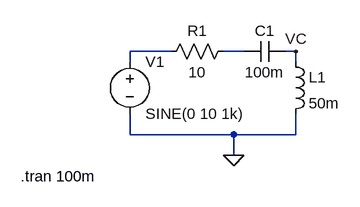
[diagram p0: schematic Exp-3.asc]
Exp-3.asc, the LTspice schematic file:
Version 4
SHEET 1 880 680
WIRE 160 48 96 48
WIRE 272 48 240 48
WIRE 352 48 336 48
WIRE 96 64 96 48
WIRE 352 64 352 48
WIRE 96 176 96 144
WIRE 256 176 96 176
WIRE 352 176 352 144
WIRE 352 176 256 176
WIRE 256 208 256 176
FLAG 256 208 0
FLAG 352 48 VC
SYMBOL res 256 32 R90
WINDOW 0 0 56 VBottom 2
WINDOW 3 32 56 VTop 2
SYMATTR InstName R1
SYMATTR Value 10
SYMBOL voltage 96 48 R0
WINDOW 123 0 0 Left 0
WINDOW 39 0 0 Left 0
SYMATTR InstName V1
SYMATTR Value SINE(0 10 1k)
SYMBOL ind 336 48 R0
SYMATTR InstName L1
SYMATTR Value 50m
SYMBOL cap 336 32 R90
WINDOW 0 0 32 VBottom 2
WINDOW 3 32 32 VTop 2
SYMATTR InstName C1
SYMATTR Value 100m
TEXT -72 240 Left 2 !.tran 100m

The netlist it stands for:
* Exp-3.asc
R1 N002 N001 10
V1 N001 0 SINE(0 10 1k)
L1 VC 0 50m
C1 VC N002 100m
.tran 100m
.backanno
.end